# Altium schematic sheet MCU.SchDoc
size A3; SheetNumber: 3; SheetTotal: 5
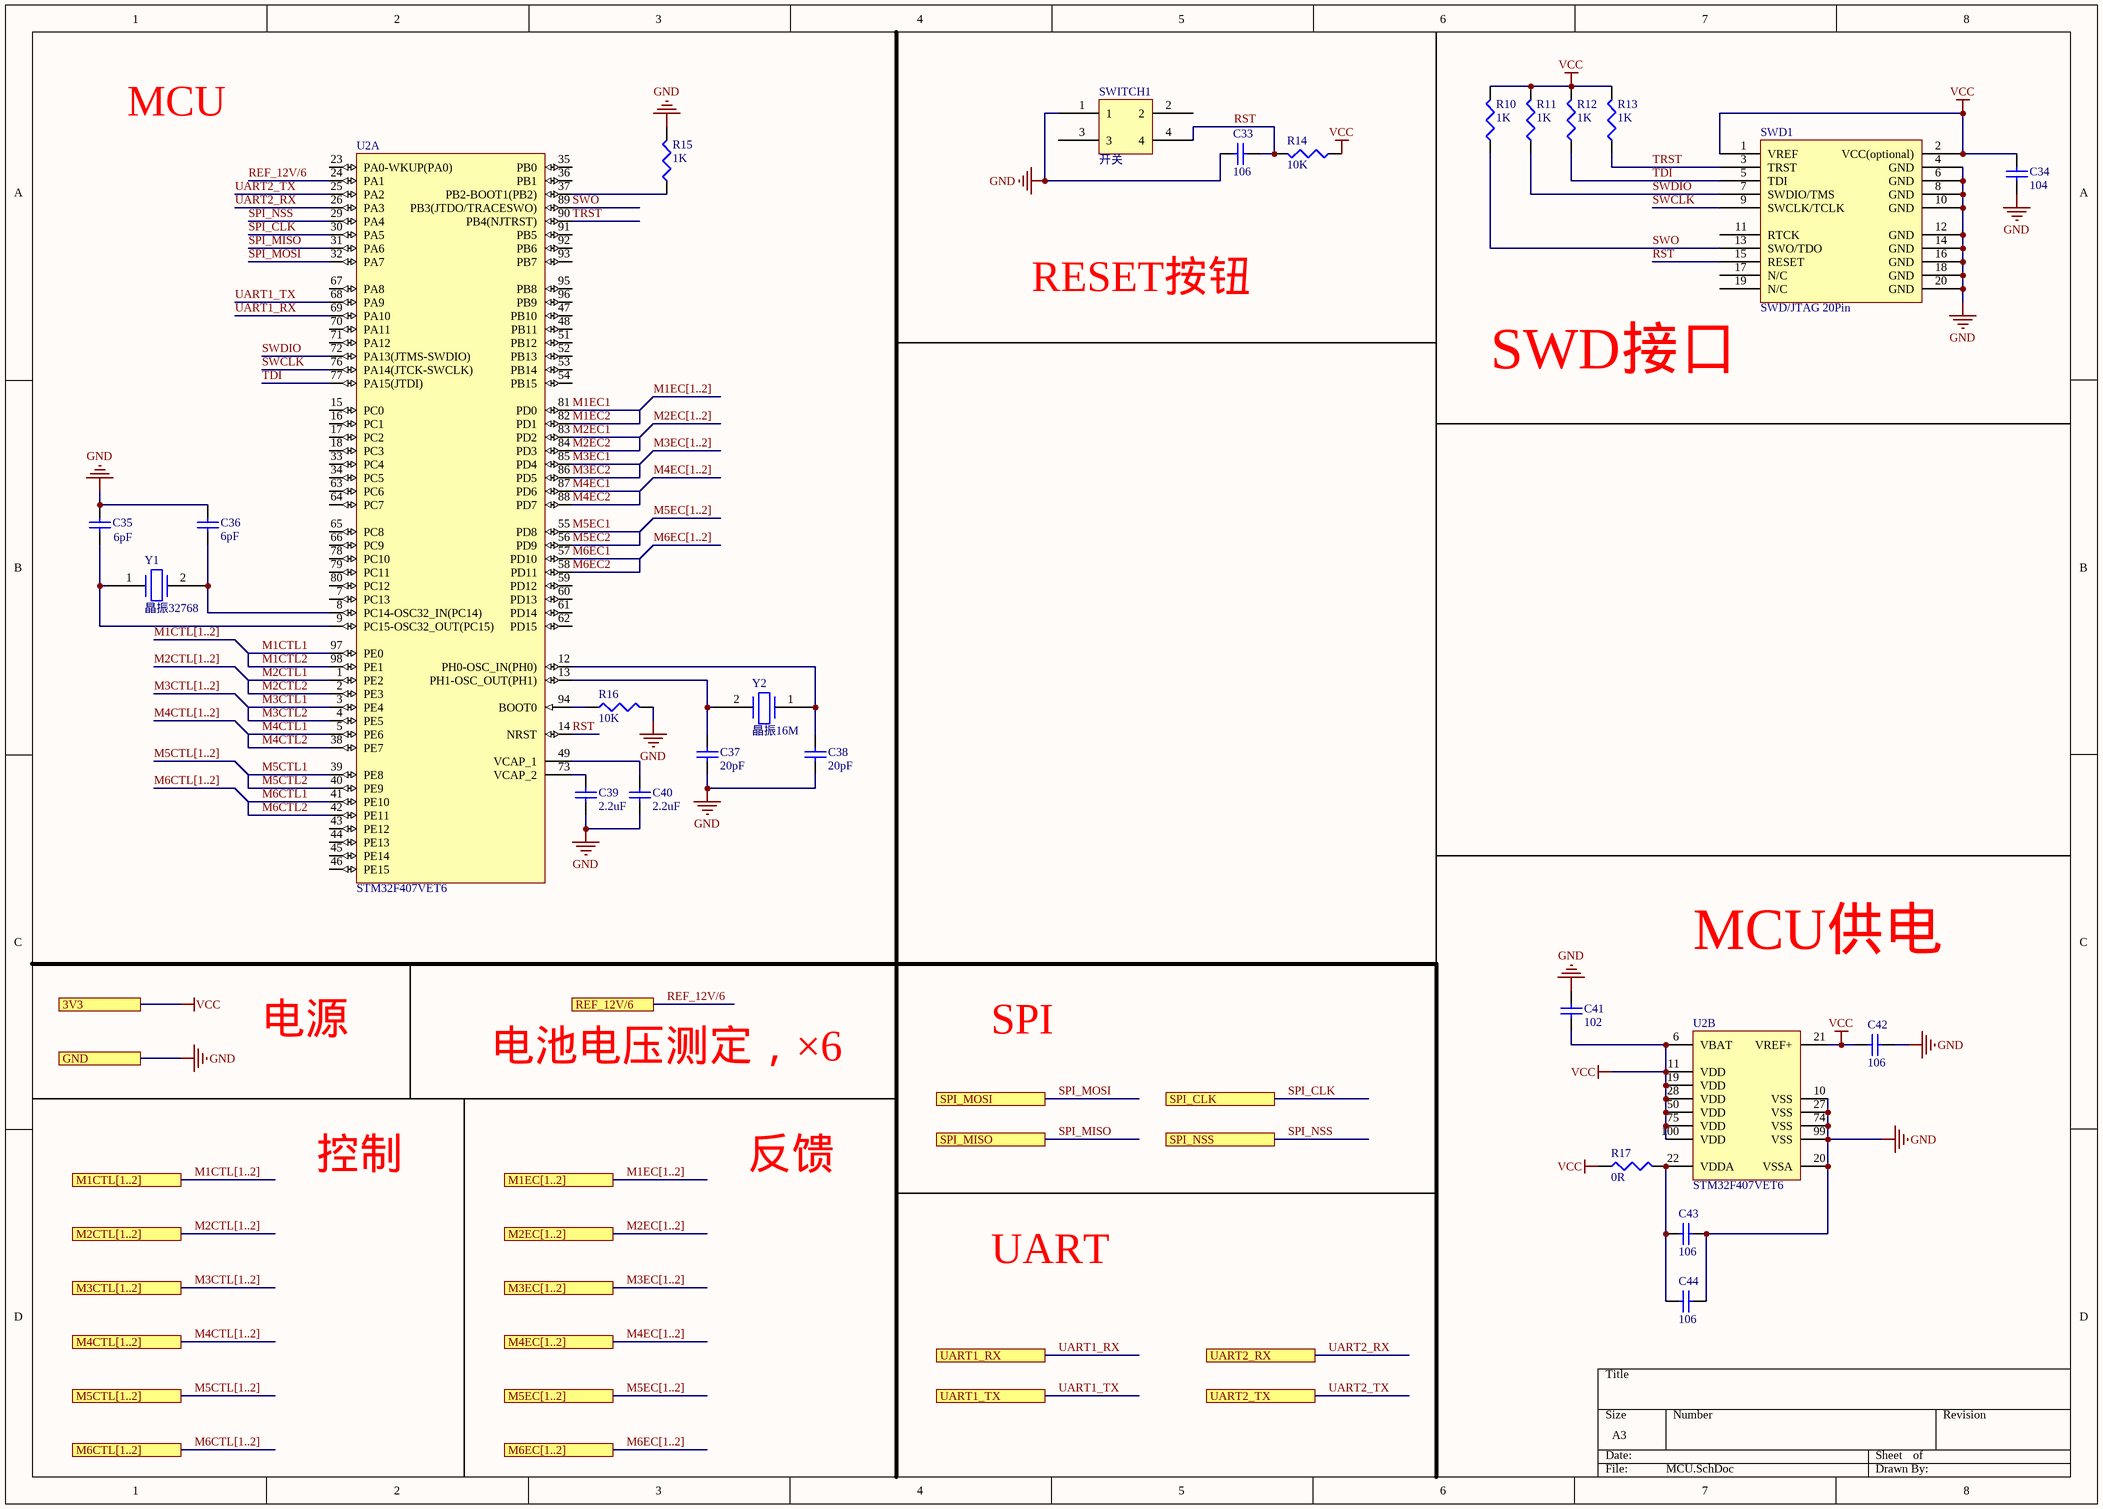
[diagram p0: MCU.SchDoc]

## Parts
C33  106  [MY0805]
C34  104  [MY0805]
C35  6pF  [MY0805]
C36  6pF  [MY0805]
C37  20pF  [MY0805]
C38  20pF  [MY0805]
C39  2.2uF  [MY0805]
C40  2.2uF  [MY0805]
C41  102  [MY0805]
C42  106  [MY0805]
C43  106  [MY0805]
C44  106  [MY0805]
R10  1K  [MY0805]
R11  1K  [MY0805]
R12  1K  [MY0805]
R13  1K  [MY0805]
R14  10K  [MY0805]
R15  1K  [MY0805]
R16  10K  [MY0805]
R17  0R  [MY0805]
SWD1  SWD/JTAG 20Pin  [SWD 20Pin]
SWITCH1  开关  [开关]
U2  STM32F407VET6  [STM-LQFP100_N]  (parts A,B of 2)
Y1  晶振32768  [晶振32768K_AT38]
Y2  晶振16M  [晶振16M]

## Ports
3V3, GND, M1CTL[1..2], M1EC[1..2], M2CTL[1..2], M2EC[1..2], M3CTL[1..2], M3EC[1..2], M4CTL[1..2], M4EC[1..2], M5CTL[1..2], M5EC[1..2], M6CTL[1..2], M6EC[1..2], REF_12V/6, SPI_CLK, SPI_MISO, SPI_MOSI, SPI_NSS, UART1_RX, UART1_TX, UART2_RX, UART2_TX

## Nets
GND: C33.1 C34.1 C35.2 C36.2 C37.2 C38.2 C39.1 C40.1 C41.1 C42.2 C43.2 C44.2 R15.2 R16.2 SWD1.4(GND) SWD1.6(GND) SWD1.8(GND) SWD1.10(GND) SWD1.12(GND) SWD1.14(GND) SWD1.16(GND) SWD1.18(GND) SWD1.20(GND) SWITCH1.1 U2.10(VSS) U2.20(VSSA) U2.27(VSS) U2.74(VSS) U2.99(VSS) ; port GND
VCC: C34.2 C41.2 C42.1 R10.2 R11.2 R12.2 R13.2 R14.1 R17.1 SWD1.1(VREF) SWD1.2(VCC(optional)) U2.6(VBAT) U2.11(VDD) U2.19(VDD) U2.21(VREF+) U2.28(VDD) U2.50(VDD) U2.75(VDD) U2.100(VDD) ; port 3V3
M1CTL1: U2.97(PE0)
M1CTL2: U2.98(PE1)
M1EC1: U2.81(PD0)
M1EC2: U2.82(PD1)
M2CTL1: U2.1(PE2)
M2CTL2: U2.2(PE3)
M2EC1: U2.83(PD2)
M2EC2: U2.84(PD3)
M3CTL1: U2.3(PE4)
M3CTL2: U2.4(PE5)
M3EC1: U2.85(PD4)
M3EC2: U2.86(PD5)
M4CTL1: U2.5(PE6)
M4CTL2: U2.38(PE7)
M4EC1: U2.87(PD6)
M4EC2: U2.88(PD7)
M5CTL1: U2.39(PE8)
M5CTL2: U2.40(PE9)
M5EC1: U2.55(PD8)
M5EC2: U2.56(PD9)
M6CTL1: U2.41(PE10)
M6CTL2: U2.42(PE11)
M6EC1: U2.57(PD10)
M6EC2: U2.58(PD11)
REF_12V/6: U2.24(PA1) ; port REF_12V/6
RST: C33.2 R14.2 SWD1.15(RESET) SWITCH1.4 U2.14(NRST)
SPI_CLK: U2.30(PA5) ; port SPI_CLK
SPI_MISO: U2.31(PA6) ; port SPI_MISO
SPI_MOSI: U2.32(PA7) ; port SPI_MOSI
SPI_NSS: U2.29(PA4) ; port SPI_NSS
SWCLK: SWD1.9(SWCLK/TCLK) U2.76(PA14(JTCK-SWCLK))
SWDIO: R11.1 SWD1.7(SWDIO/TMS) U2.72(PA13(JTMS-SWDIO))
SWO: R10.1 SWD1.13(SWO/TDO) U2.89(PB3(JTDO/TRACESWO))
TDI: R12.1 SWD1.5(TDI) U2.77(PA15(JTDI))
TRST: R13.1 SWD1.3(TRST) U2.90(PB4(NJTRST))
UART1_RX: U2.69(PA10) ; port UART1_RX
UART1_TX: U2.68(PA9) ; port UART1_TX
UART2_RX: U2.26(PA3) ; port UART2_RX
UART2_TX: U2.25(PA2) ; port UART2_TX
NetC35_1: C35.1 U2.9(PC15-OSC32_OUT(PC15)) Y1.1
NetC36_1: C36.1 U2.8(PC14-OSC32_IN(PC14)) Y1.2
NetC37_1: C37.1 U2.13(PH1-OSC_OUT(PH1)) Y2.2
NetC38_1: C38.1 U2.12(PH0-OSC_IN(PH0)) Y2.1
NetC39_2: C39.2 U2.73(VCAP_2)
NetC40_2: C40.2 U2.49(VCAP_1)
NetC43_1: C43.1 C44.1 R17.2 U2.22(VDDA)
NetR15_1: R15.1 U2.37(PB2-BOOT1(PB2))
NetR16_1: R16.1 U2.94(BOOT0)

Not connected (* = marked no-connect by the designer): SWD1 11(RTCK) 17(N/C) 19(N/C); SWITCH1 2 3; U2 7(PC13) 15(PC0) 16(PC1) 17(PC2) 18(PC3) 23(PA0-WKUP(PA0)) 33(PC4) 34(PC5) 35(PB0) 36(PB1) 43(PE12) 44(PE13) 45(PE14) 46(PE15) 47(PB10) 48(PB11) 51(PB12) 52(PB13) 53(PB14) 54(PB15) 59(PD12) 60(PD13) 61(PD14) 62(PD15) 63(PC6) 64(PC7) 65(PC8) 66(PC9) 67(PA8) 70(PA11) 71(PA12) 78(PC10) 79(PC11) 80(PC12) 91(PB5) 92(PB6) 93(PB7) 95(PB8) 96(PB9)

## Buses and harness runs
bus M1CTL[1..2]
bus M1CTL[1..2] = port M1CTL[1..2]
bus M1EC[1..2]
bus M1EC[1..2] = port M1EC[1..2]
bus M2CTL[1..2]
bus M2CTL[1..2] = port M2CTL[1..2]
bus M2EC[1..2]
bus M2EC[1..2] = port M2EC[1..2]
bus M3CTL[1..2]
bus M3CTL[1..2] = port M3CTL[1..2]
bus M3EC[1..2]
bus M3EC[1..2] = port M3EC[1..2]
bus M4CTL[1..2]
bus M4CTL[1..2] = port M4CTL[1..2]
bus M4EC[1..2]
bus M4EC[1..2] = port M4EC[1..2]
bus M5CTL[1..2]
bus M5CTL[1..2] = port M5CTL[1..2]
bus M5EC[1..2]
bus M5EC[1..2] = port M5EC[1..2]
bus M6CTL[1..2]
bus M6CTL[1..2] = port M6CTL[1..2]
bus M6EC[1..2]
bus M6EC[1..2] = port M6EC[1..2]

## Notes on the sheet
- MCU
- RESET按钮
- SWD接口
- MCU供电
- 电源
- SPI
- 电池电压测定，×6
- 控制
- 反馈
- UART

## Library data of the parts
C33 C34 C37-C44 = Cap: Capacitor; Published: 8-Jun-2000; LatestRevisionDate: 17-Jul-2002; LatestRevisionNote: Re-released for DXP Platform.; PackageReference: RAD-0.3; Publisher: Altium Limited; PackageDescription: Radial Cap, Thru-Hole; 2 Leads; 0.3 in Pin Spacing
  C33 C42-C44: Value: 106
  C34: Value: 104
  C37 C38: Value: 20PF
  C39 C40: Value: 2.2uF
  C41: Value: 102
C35 C36 = Cap: Capacitor; Value: 20PF; Published: 8-Jun-2000; LatestRevisionDate: 17-Jul-2002; LatestRevisionNote: Re-released for DXP Platform.; PackageReference: RAD-0.3; Publisher: Altium Limited; PackageDescription: Radial Cap, Thru-Hole; 2 Leads; 0.3 in Pin Spacing
R10-R17 = Res3: Resistor; Published: 8-Jun-2000; LatestRevisionDate: 29-May-2009; LatestRevisionNote: IPC-7351 Footprint Added.; PackageReference: J1-0603; Publisher: Altium Limited; PackageDescription: Chip Resistor
  R10-R13 R15: Value: 1K
  R14 R16: Value: 10K
  R17: Value: 0R
U2 = STM32F407VET6: ARM Cortex-M4 32-bit MCU+FPU, 210 DMIPS, 512 kB Flash, 192 kB Internal RAM, 82 I/Os, 100-pin LQFP, -40 to 85 degC, Tray; Manufacturer: STMicroelectronics; D/A Converter: 2x12-bit; FLASH Size (Prog) (kB): 512; I/Os (High Current): 82; Internal RAM Size (kB): 192; Operating Frequency(F) (Processor speed) (MHz): 168; Supply Voltage(Vcc) max (V): 3.6; Supply Voltage(Vcc) min (V): 1.8; DatasheetVersion: Rev. 4; PackageVersion: Rev. 1, 06/2013; PackageReference: LQFP100; PackageDescription: 100-Pin Low Profile Quad Flat Package, 14 x 14 mm Body, 0.5 mm Pitch; Supplier 1: Digi-Key; Supplier Part Number 1: 497-12075-ND; Supplier 2: Farnell; Supplier Part Number 2: 2064367; Supplier 3: Newark; Supplier Part Number 3: 73T2332; Supplier 4: Mouser; Supplier Part Number 4: 511-STM32F407VET6; Core: ARM Cortex-M4; Packing: Tray; Mounting Technology: Surface Mount; PartNumber: STM32F407VET6; ComponentLink1Description: Manufacturer URL; ComponentLink1URL: http://www.st.com/web/en/home.html; ComponentLink2Description: Datasheet; ComponentLink2URL: http://www.st.com/st-web-ui/static/active/en/resource/technical/document/datasheet/DM00037051.pdf; ComponentLink3Description: Package Specification; ComponentLink3URL: http://www.st.com/st-web-ui/static/active/en/resource/technical/document/data_brief/DM00071938.pdf
Y1 Y2 = 晶振